# EAGLE design ML8511_Breakout (EAGLE 6.5.0)
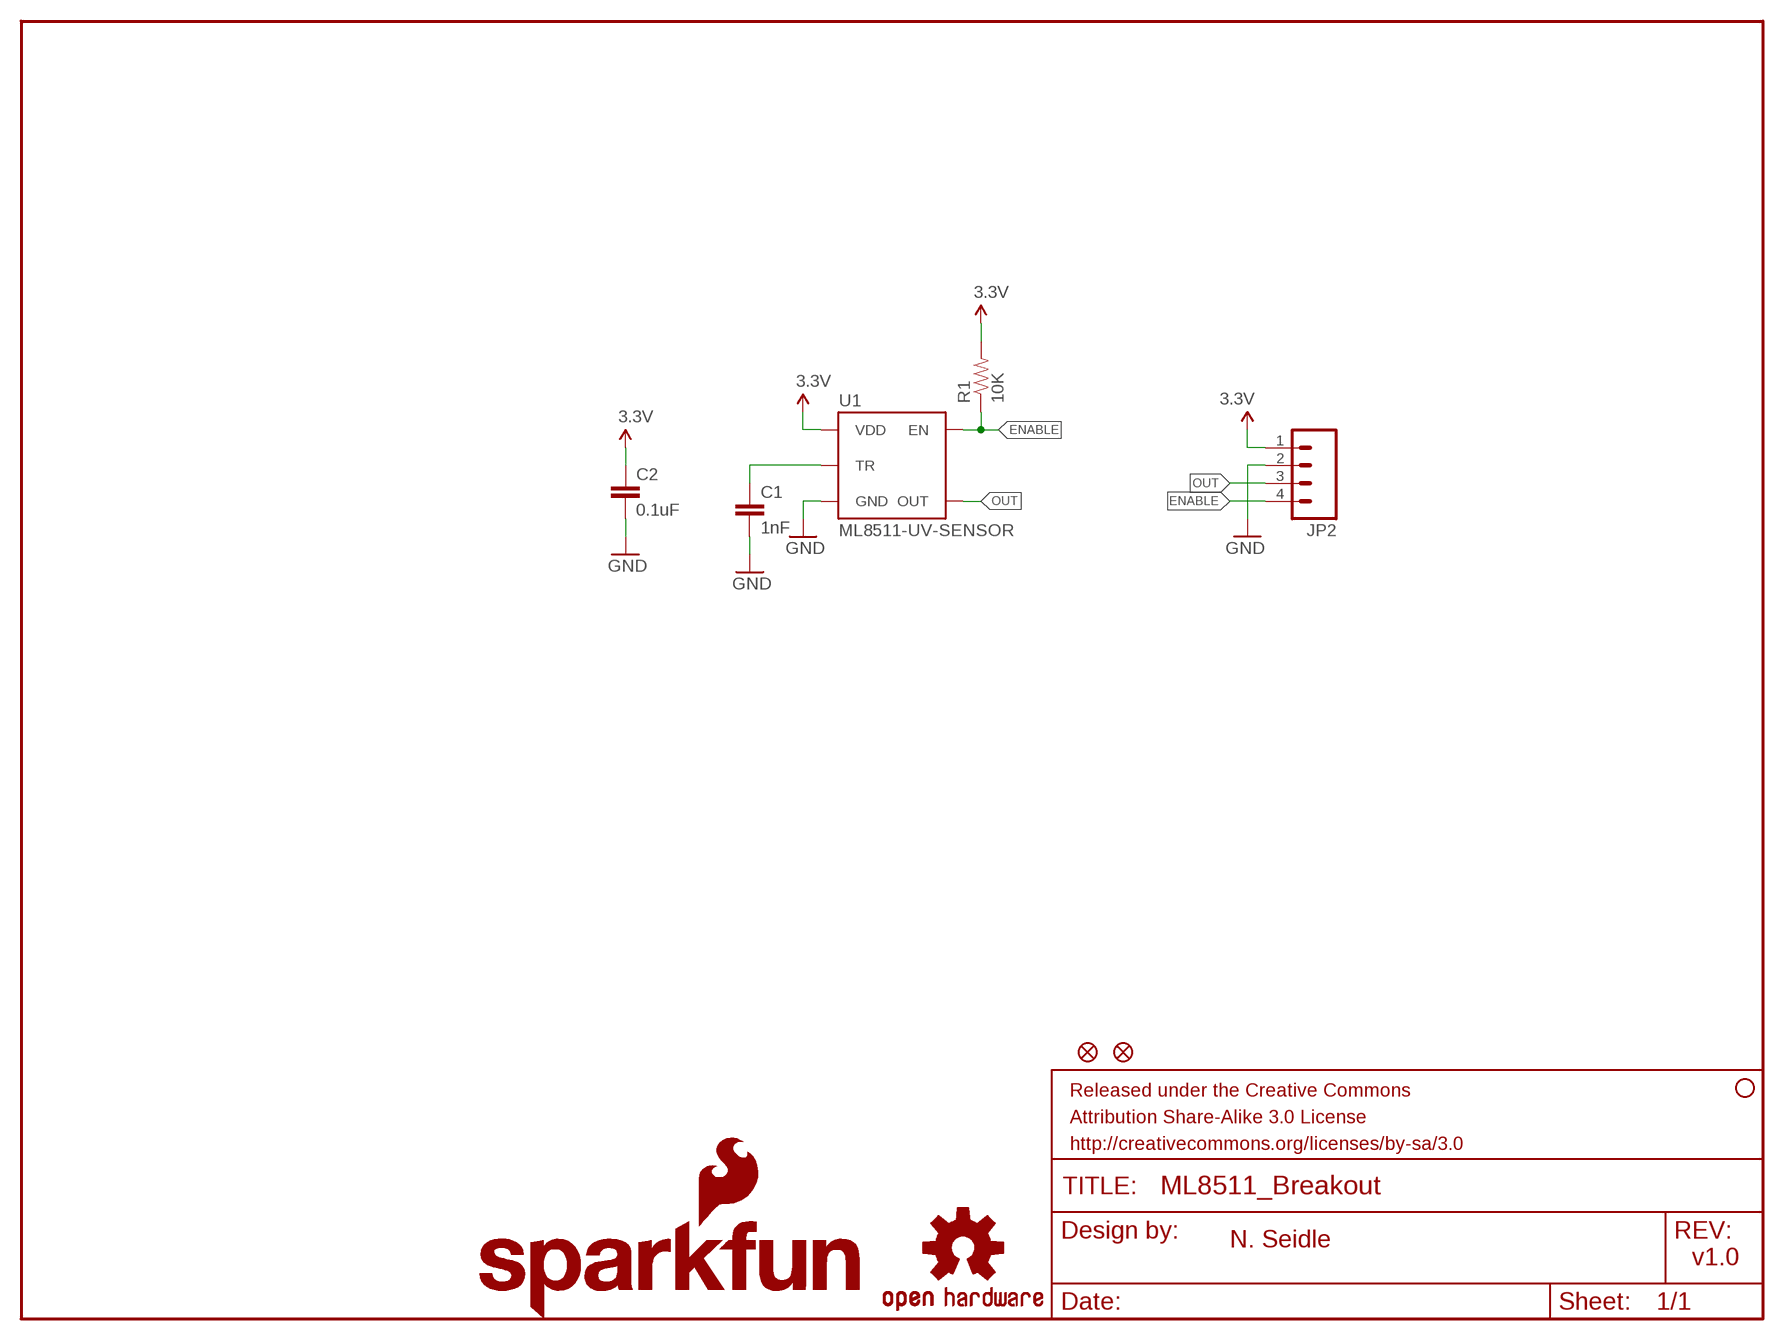
[diagram p0: schematic, sheet 1]

## Parts
C1  1nF  1NF/1000PF-50V-10%(0603)  [0603-CAP]
C2  0.1uF  0.1UF-25V(+80/-20%)(0603)  [0603-CAP]
FID1  FIDUCIAL1X2  [FIDUCIAL-1X2]
FID2  FIDUCIAL1X2  [FIDUCIAL-1X2]
FRAME2  FRAME-LETTER  [CREATIVE_COMMONS]
JP2  M04PTH  [1X04]
LOGO2  OSHW-LOGOS  [OSHW-LOGO-S]
LOGO3  SFE_LOGO_FLAME.1_INCH  [SFE_LOGO_FLAME_.1]
LOGO4  SFE_LOGO_NAME.1_INCH  [SFE_LOGO_NAME_.1]
R1  10K  10KOHM1/10W1%(0603)0603  [0603-RES]
STANDOFF1  STAND-OFF  [STAND-OFF]
U1  ML8511-UV-SENSOR  ML8511-UV-SENSORSMD  [ML8511]

## Nets
3.3V: C2.1 JP2.1 R1.2 U1.7(VDD)
ENABLE: JP2.4 R1.1 U1.4(EN)
GND: C1.2 C2.2 JP2.2 U1.5(GND)
N$3: C1.1 U1.10(TR)
OUT: JP2.3 U1.8(OUT)

## Notes on the sheet
- N. Seidle
- v1.0

## Library data of the parts
C1 = SparkFun-Capacitors:1NF/1000PF-50V-10%(0603): CAP-07886; PROD_ID: CAP-07886
C2 = SparkFun-Capacitors:0.1UF-25V(+80/-20%)(0603): CAP-00810 Ceramic Standard decoupling cap; PROD_ID: CAP-00810
FID1 FID2 = SparkFun-Aesthetics:FIDUCIAL: Fiducial Alignment Points Various fiducial points for machine vision alignment.
FRAME2 = SparkFun-Aesthetics:FRAME-LETTER: Schematic Frame Standard 8.5x11 US Letter frame
JP2 = SparkFun-Connectors:M04: Header 4 Standard 4-pin 0.1" header. Use with straight break away headers (SKU : PRT-00116), right angle break away headers (PRT-00553), swiss pins (PRT-00743), machine pins (PRT-00117), and female headers (PRT-00115). Molex polarized connector foot print use with SKU : PRT-08231 with associated crimp pins and housings. 1MM SMD Version SKU: PRT-10208
LOGO2 = SparkFun-Aesthetics:OSHW-LOGO: Open Source Hardware Logo This logo indicates the piece of hardware it is found on incorporates a OSHW license and/or adheres to the definition of open source hardware found here: http://freedomdefined.org/OSHW
LOGO3 = SparkFun-Aesthetics:SFE_LOGO_FLAME: SFE Logo, flame only This is the SparkFun flame logo. The logo on the schematic will always be the same size; the package variant is the height of the flame. Default layer for the logo on the board is tSilk.
LOGO4 = SparkFun-Aesthetics:SFE_LOGO_NAME: SFE Logo, name only This is the SparkFun name logo. The logo on the schematic will always be the same size; the package variant is the height of the flame part of the logo (or the height the flame would be, if it were drawn). Default layer for the logo on the board is tSilk.
R1 = SparkFun-Resistors:10KOHM1/10W1%(0603): RES-00824; PROD_ID: RES-00824
STANDOFF1 = SparkFun-Electromechanical:STAND-OFF: #4 Stand Off This is the mechanical footprint for a #4 phillips button head screw. Use the keepout ring to avoid running the screw head into surrounding components. SKU : PRT-00447
U1 = ML8511:ML8511-UV-SENSOR

## Board
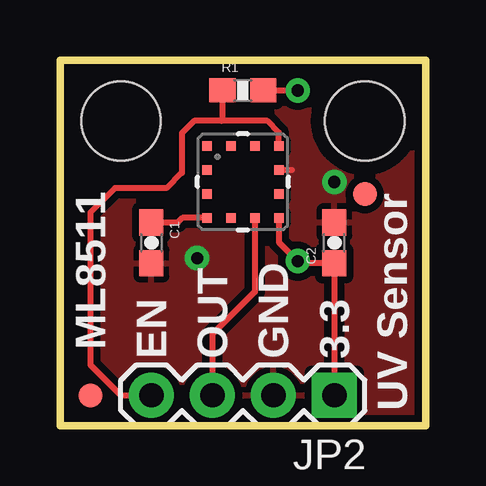
[diagram p1: board, top side]
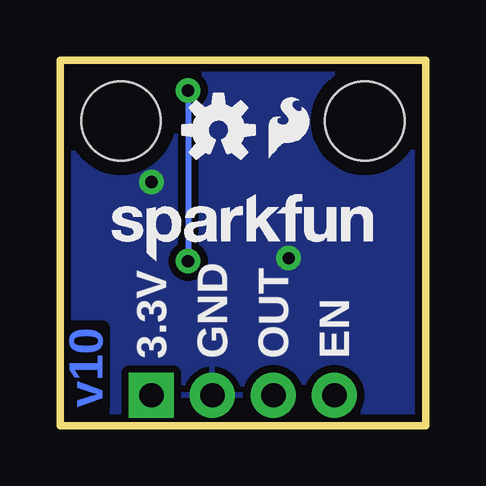
[diagram p2: board, bottom side, seen from below]

Size 15.24 x 15.24 mm. Coordinates in mm from the lower left corner, seen from the top.
Outline: 0,15.24 0,0 15.24,0 15.24,15.24 0,15.24
Copper layers (1*16): Top 0.035mm / dielectric 1.5mm / Bottom 0.035mm
Design rules "SparkFun": minimum track width 8mil, minimum drill 20mil, track to track 8mil, track to pad 8mil, pad to pad 8mil, via to via 8mil, smd to smd 8mil, copper to edge 10mil, drill to drill 8mil, minimum pad ring 12mil, minimum via ring 10mil, stop-mask expansion 4mil, vias tented up to drill 25mil, thermal gap 10mil
tRestrict: area 6.6,9.3 to 8.6,11.2; area 9,11 to 9.1,11.2; area 9,10.2 to 9.1,10.3

### Footprints (pad centres in the part's own frame; a part is rotated, then mirrored left to right if it is on the bottom)
0603-CAP = smd 1.1 x 1: 1 -0.85,0; 2 0.85,0
FIDUCIAL-1X2 = smd 1 x 1: 1 0,0
1X04 = drill 1.016 pad 1.88 square: 1 0,0 | drill 1.016 pad 1.88: 2 2.54,0; 3 5.08,0; 4 7.62,0
0603-RES = smd 1.1 x 1: 1 -0.85,0; 2 0.85,0
STAND-OFF = hole 3.302: 0,0
ML8511 = smd 0.4 x 0.4: 1 -1.5,-1.5; 2 -1.5,-0.5; 3 -1.5,0.5; 4 -1.5,1.5; 5 -0.5,1.5; 6 0.5,1.5; 7 1.5,1.5; 8 1.5,0.5; 9 1.5,-0.5; 10 1.5,-1.5; 11 0.5,-1.5; 12 -0.5,-1.5

### Placement (x,y rotation side)
C1  3.81,7.62 270 top
C2  11.43,7.62 90 top
FID1  12.7,9.65 0 top
FID2  1.27,1.27 0 top
FRAME2  -15.24,-10.16 0 top  (outside the outline)
JP2  11.43,1.27 180 top
LOGO2  8.64,12.32 0 bottom
LOGO3  6.86,10.79 0 bottom
LOGO4  13.59,6.35 0 bottom
R1  7.62,13.97 0 top
STANDOFF1  12.7,12.7 0 top
STANDOFF2  STAND-OFF  [STAND-OFF]  2.54,12.7 0 top
U1  7.62,10.16 270 top

### Tracks (layer width: path | path; a pad name or v marks a point on that pad's centre or on a via)
3.3V  (via drill 0.51)
  Top 0.254: JP2.1 C2.1 9.99,6.77 v9.91,6.86 9.12,7.64 U1.7 | R1.2 v9.91,13.97
  Bottom 0.254: v9.91,13.97 v9.91,6.86
ENABLE
  Top 0.254: JP2.4 2.54,1.27 1.27,2.54 1.27,8.89 2.29,9.91 4.45,9.91 5.08,10.54 5.08,12.19 5.59,12.7 6.73,12.7 | U1.4 9.12,12.22 8.64,12.7 6.73,12.7 | R1.1 6.77,12.74 6.73,12.7
GND  (via drill 0.51)
  Top 0.254: U1.5 9.66,10.66
  other vias: 11.43,10.16 5.71,6.99
  pour Bottom (isolate 0.305): 0,15.24 15.24,15.24 15.24,0 0,0
  pour Top (isolate 0.305): 0,15.24 15.24,15.24 15.24,0 0,0
N$3
  Top 0.254: U1.10 5.1,8.66 4.91,8.47 C1.1
OUT
  Top 0.254: U1.8 8.12,5.58 6.35,3.81 JP2.3

### Text on the board
Bottom: v10
tPlace: ML8511 | EN | OUT | GND | 3.3 | UV Sensor
bPlace: EN | OUT | GND | 3.3V
Document: N. Seidle
tDocu: N. Seidle